# EAGLE design Domino Single Ethernet PoE No Teardrop (EAGLE 6.5.0)
DATABASE: ./../Common/BOM/Domino_DB.txt; DRAWN: M.STEMPIN; REV: A
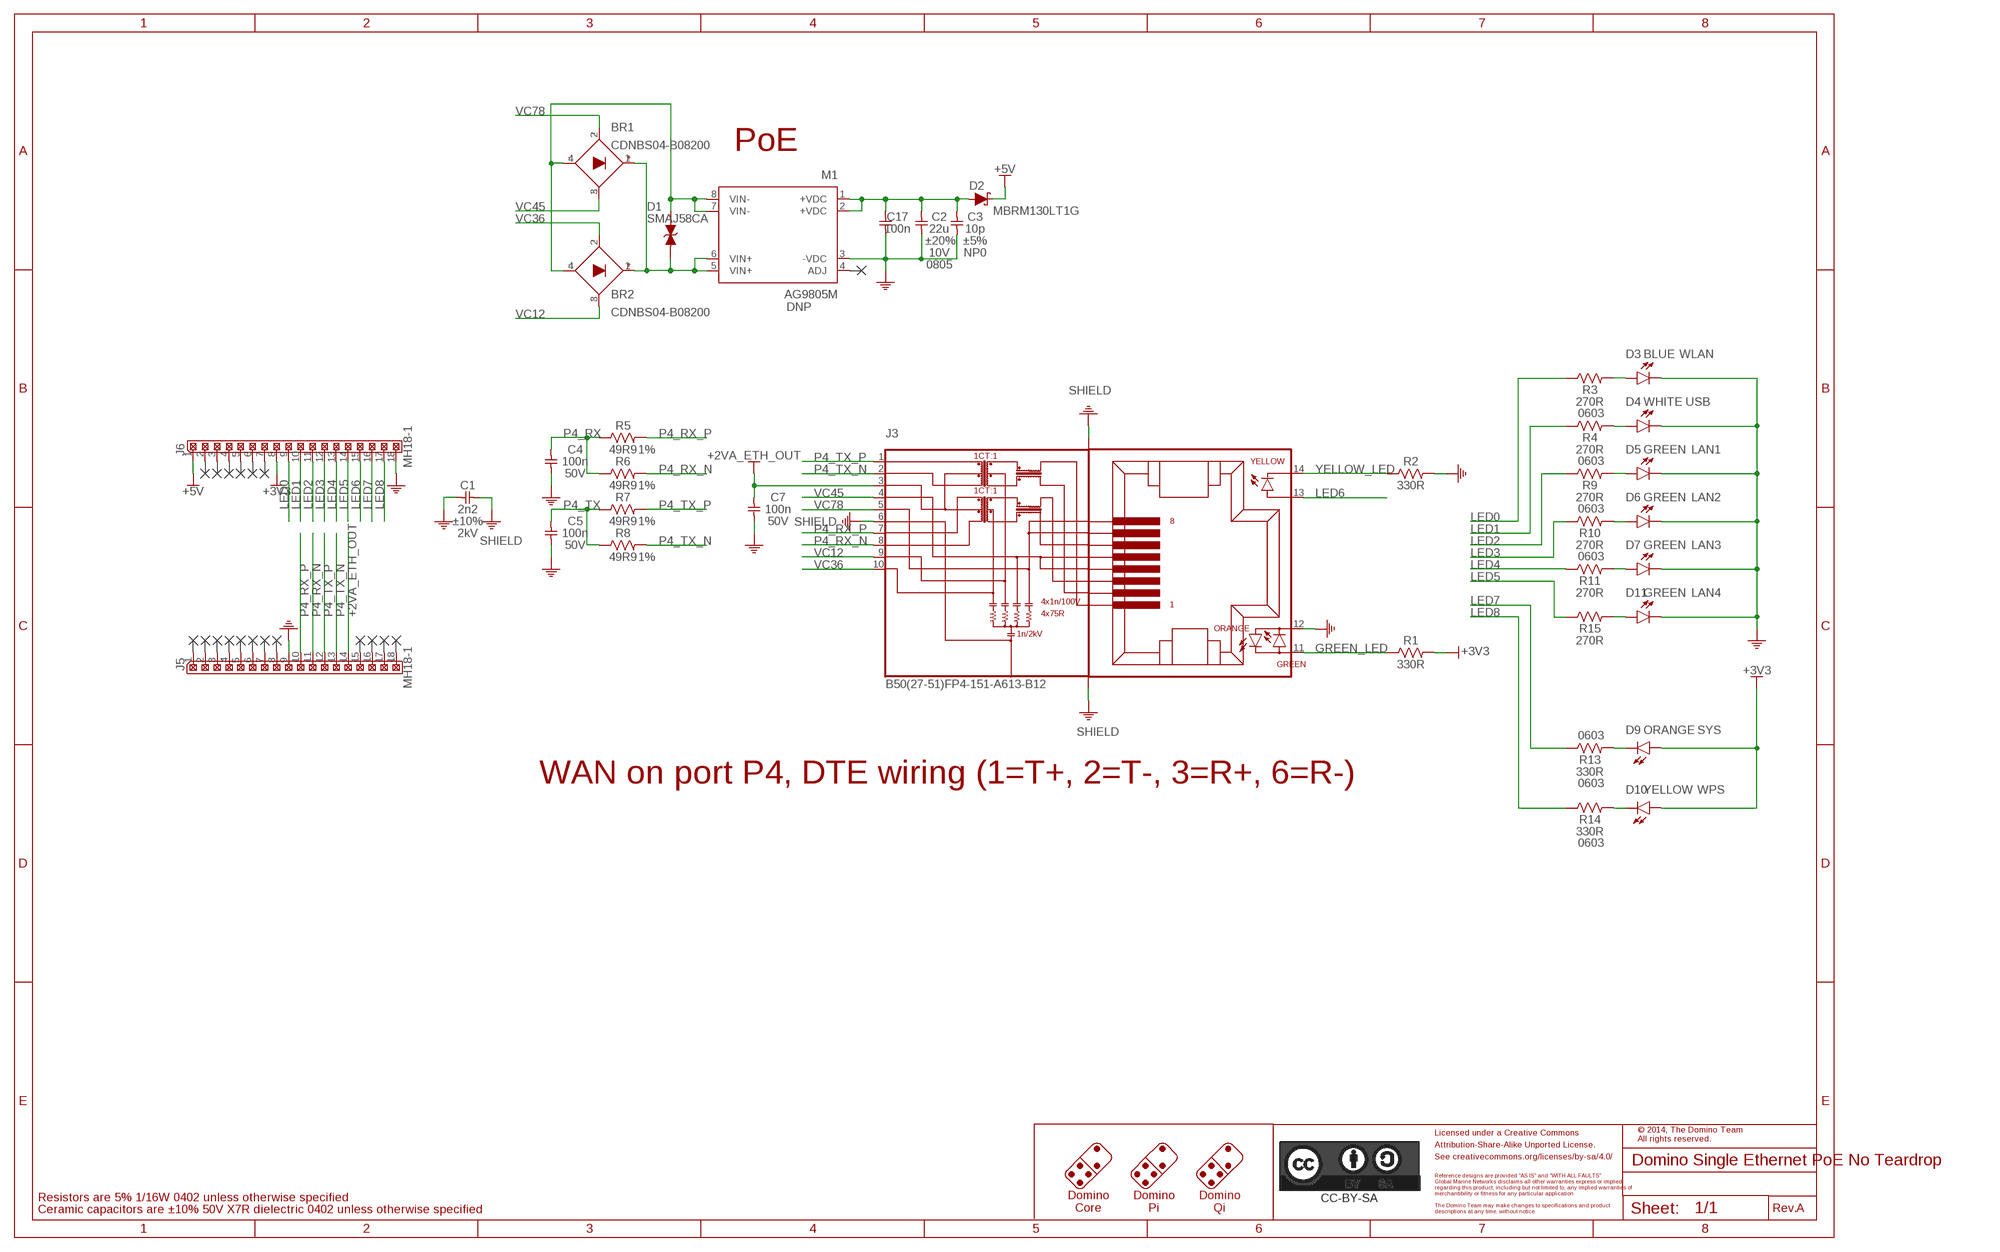
[diagram p0: schematic, sheet 1]
PORT1 (NC): BOM: EXCLUDE
PORT2 (NC): BOM: EXCLUDE
PORT3 (NC): BOM: EXCLUDE
PORT4 (NC): BOM: EXCLUDE
PORT5 (NC): BOM: EXCLUDE
PORT6 (NC): BOM: EXCLUDE
PORT7 (NC): BOM: EXCLUDE
PORT8 (NC): BOM: EXCLUDE
PORT9 (NC): BOM: EXCLUDE
PORT10 (NC): BOM: EXCLUDE
PORT11 (NC): BOM: EXCLUDE
PORT12 (NC): BOM: EXCLUDE
PORT13 (NC): BOM: EXCLUDE
PORT14 (NC): BOM: EXCLUDE
PORT15 (NC): BOM: EXCLUDE
PORT22 (NC): BOM: EXCLUDE
PORT26 (NC): BOM: EXCLUDE
PORT27 (NC): BOM: EXCLUDE
PORT28 (NC): BOM: EXCLUDE

## Parts
BR1  CDNBS04-B08200  [NBS04]
BR2  CDNBS04-B08200  [NBS04]
C1  2n2  CAP_1206  [C1206]
C2  22u  CAP_0805  [C0805]
C3  10p  CAP_0402  [C0402]
C4  100n  CAP_0402  [C0402]
C5  100n  CAP_0402  [C0402]
C7  100n  CAP_0402  [C0402]
C17  100n  CAP_0402  [C0402]
CC-BY-SA1  CC-BY-SA_LOGO  [CC-BY-SA_LOGO]
D1  SMAJ58CA  [SMA]
D2  MBRM130LT1G  [DO-216AA]
D3  BLUE  LED_0603  [LED0603]
D4  WHITE  LED_0603  [LED0603]
D5  GREEN  LED_0603  [LED0603]
D6  GREEN  LED_0603  [LED0603]
D7  GREEN  LED_0603  [LED0603]
D9  ORANGE  LED_0603  [LED0603]
D10  YELLOW  LED_0603  [LED0603]
D11  GREEN  LED_0603  [LED0603]
J3  B50(27-51)FP4-151-A613-B12  [B50(27-51)FP4-151-A613-B12]
J5  MH18-1  [MH18-1-0.1]
J6  MH18-1  [MH18-1-0.1]
M1  AG9805M  [AG9800M]
R1  330R  RES_0402  [R0402]
R2  330R  RES_0402  [R0402]
R3  270R  RES_0603  [R0603]
R4  270R  RES_0603  [R0603]
R5  49R9  RES_0402  [R0402]
R6  49R9  RES_0402  [R0402]
R7  49R9  RES_0402  [R0402]
R8  49R9  RES_0402  [R0402]
R9  270R  RES_0603  [R0603]
R10  270R  RES_0603  [R0603]
R11  270R  RES_0603  [R0603]
R13  330R  RES_0603  [R0603]
R14  330R  RES_0603  [R0603]
R15  270R  RES_0603  [R0603]

## Nets
+: BR1.1(+) BR2.1(+) D1.C M1.5(VIN+) M1.6(VIN+)
+2VA_ETH_OUT: C7.2 J3.3 J5.14
+3V3: D9.2(A) D10.2(A) J6.8 R1.2
+5V: D2.1(C) J6.1
+VDC@1: C2.1 C3.1 C17.1 D2.2(A) M1.1(+VDC) M1.2(+VDC)
-: BR1.4(-) BR2.4(-) D1.A M1.7(VIN-) M1.8(VIN-)
GND: C1.1 C2.2 C3.2 C4.1 C5.1 C7.1 C17.2 D3.1(C) D4.1(C) D5.1(C) D6.1(C) D7.1(C) D11.1(C) J3.12 J5.9 J6.18 M1.3(-VDC) R2.2
GREEN_LED: J3.11 R1.1
LED0: J6.9 R3.1
LED1: J6.10 R4.1
LED2: J6.11 R9.1
LED3: J6.12 R10.1
LED4: J6.13 R11.1
LED5: J6.14 R15.1
LED6: J3.13 J6.15
LED7: J6.16 R13.1
LED8: J6.17 R14.1
N$2: D3.2(A) R3.2
N$3: D4.2(A) R4.2
N$4: D5.2(A) R9.2
N$5: D6.2(A) R10.2
N$6: D7.2(A) R11.2
N$8: D9.1(C) R13.2
N$9: D10.1(C) R14.2
N$10: D11.2(A) R15.2
P4_RX: C4.2 R5.1 R6.1
P4_RX_N [Ethernet]: J3.8 J5.11 R6.2
P4_RX_P [Ethernet]: J3.7 J5.10 R5.2
P4_TX: C5.2 R7.1 R8.1
P4_TX_N [Ethernet]: J3.2 J5.13 R8.2
P4_TX_P [Ethernet]: J3.1 J5.12 R7.2
SHIELD: C1.2 J3.6 J3.SH$1(SHIELD) J3.SH$2(SHIELD)
VC12 [PoE]: BR2.3(AC2) J3.9
VC36 [PoE]: BR2.2(AC1) J3.10
VC45 [PoE]: BR1.3(AC2) J3.4
VC78 [PoE]: BR1.2(AC1) J3.5
YELLOW_LED: J3.14 R2.1
Unconnected: J5.1 J5.2 J5.3 J5.4 J5.5 J5.6 J5.7 J5.8 J5.15 J5.16 J5.17 J5.18 J6.2 J6.3 J6.4 J6.5 J6.6 J6.7 M1.4(ADJ)

## Notes on the sheet
- PoE
- WLAN
- USB
- LAN1
- LAN2
- LAN3
- LAN4
- SYS
- WAN on port P4, DTE wiring (1=T+, 2=T-, 3=R+, 6=R-)
- WPS
- Licensed under a Creative Commons
- © 2014, The Domino Team
  All rights reserved.
- Attribution-Share-Alike Unported License.
- See creativecommons.org/licenses/by-sa/4.0/
- Reference designs are provided "AS IS" and "WITH ALL FAULTS".
- Global Marine Networks disclaims all other warranties express or implied,
- regarding this product, including but not limited to, any implied warranties of
- merchantibility or fitness for any particular application.
- Resistors are 5% 1/16W 0402 unless otherwise specified
- Domino
  Core
- Domino
  Pi
- Domino
  Qi
- The Domino Team may make changes to specifications and product
- Ceramic capacitors are ±10% 50V X7R dielectric 0402 unless otherwise specified | descriptions at any time, without notice. | Rev.

## Library data of the parts
BR1 BR2 = Domino:CDNBS04-B08: Surface Mount Rectifier; PARTNO: CDNBS04-B08200; VOLT: 200V
C1 = Domino:CAP_: Capacitor; PARTNO: C1210_2n2_X7R_10%_CER_2kV; SIZE: 1206; TC: X7R; TOL: ±10%; TYPE: CER; VOLT: 2kV
C2 = Domino:CAP_: Capacitor; PARTNO: C1206_22u_X7R_20%_CER_10V; SIZE: 0805; TC: X7R; TOL: ±20%; TYPE: CER; VOLT: 10V
C3 = Domino:CAP_: Capacitor; PARTNO: C0402_10p_NP0_5%_CER_50V; SIZE: 0402; TC: NP0; TOL: ±5%; TYPE: CER; VOLT: 50V
C4 C5 C7 C17 = Domino:CAP_: Capacitor; PARTNO: C0402_100n_X7R_10%_CER_50V; SIZE: 0402; TC: X7R; TOL: ±10%; TYPE: CER; VOLT: 50V
CC-BY-SA1 = Domino:CC-BY-SA_LOGO: Attribution-Share-Alike Unported License See creativecommons.org/licenses/by-sa/3.0/ for details.; BOM: EXCLUDE
D1 = Domino:SMAJ58CA: Transient Votlage Suppression (TVS) Diode
D2 = Domino:MBRM130: Schottky Barrier Rectifier, 1A, 30V; PARTNO: MBRM130LT1G; RATE: 1A; VOLT: 30V
D3 = Domino:LED_: LED; PARTNO: LED0603-BLUE
D4 = Domino:LED_: LED; PARTNO: LED0603-WHITE
D5-D7 D11 = Domino:LED_: LED; PARTNO: LED0603-GREEN
D9 = Domino:LED_: LED; PARTNO: LED0603-ORANGE
D10 = Domino:LED_: LED; PARTNO: LED0603-YELLOW
J3 = Domino:B50(27-51)FP4-151-A613-B12: Single Port RJ45 100Base-T with PoE, Transformer, 1 Magnetic Ring, 15 Pins, 3 LEDs (Left Orange/Green, Right Yellow) Without Shielding Shell Shrapnel, 3µ Gold, Pin Back, PA66 material, No Logo; PARTNO: B50(27-51)FP4-151-A613-B12
J5 J6 = Domino:MH18-1: 18x1 Pin Male Header
M1 = Domino:AG98*M: Miniature PoE Module; DNP: T; PARTNO: Ag9800M; RATE: 9W; VOLT: 5V
R1 R2 = Domino:RES_: Resistor; PARTNO: R0402_330R_5%_62.5mW; RATE: 62.5mW; SIZE: 0402; TOL: 5%
R3 R4 R9-R11 R15 = Domino:RES_: Resistor; PARTNO: R0603_270R_5%_125mW; RATE: 125mW; SIZE: 0603; TOL: 5%
R5-R8 = Domino:RES_: Resistor; PARTNO: R0402_49R9_1%_62.5mW; RATE: 62.5mW; SIZE: 0402; TOL: 1%
R13 R14 = Domino:RES_: Resistor; PARTNO: R0603_330R_5%_125mW; RATE: 125mW; SIZE: 0603; TOL: 5%

## Net classes
1 Ethernet: width 0.254 mm, clearance 0.152 mm to class 0, clearance 0.152 mm
2 PoE: width 0.457 mm, clearance 0.254 mm to class 0, clearance 0.254 mm to class 1, clearance 0.254 mm

## Board
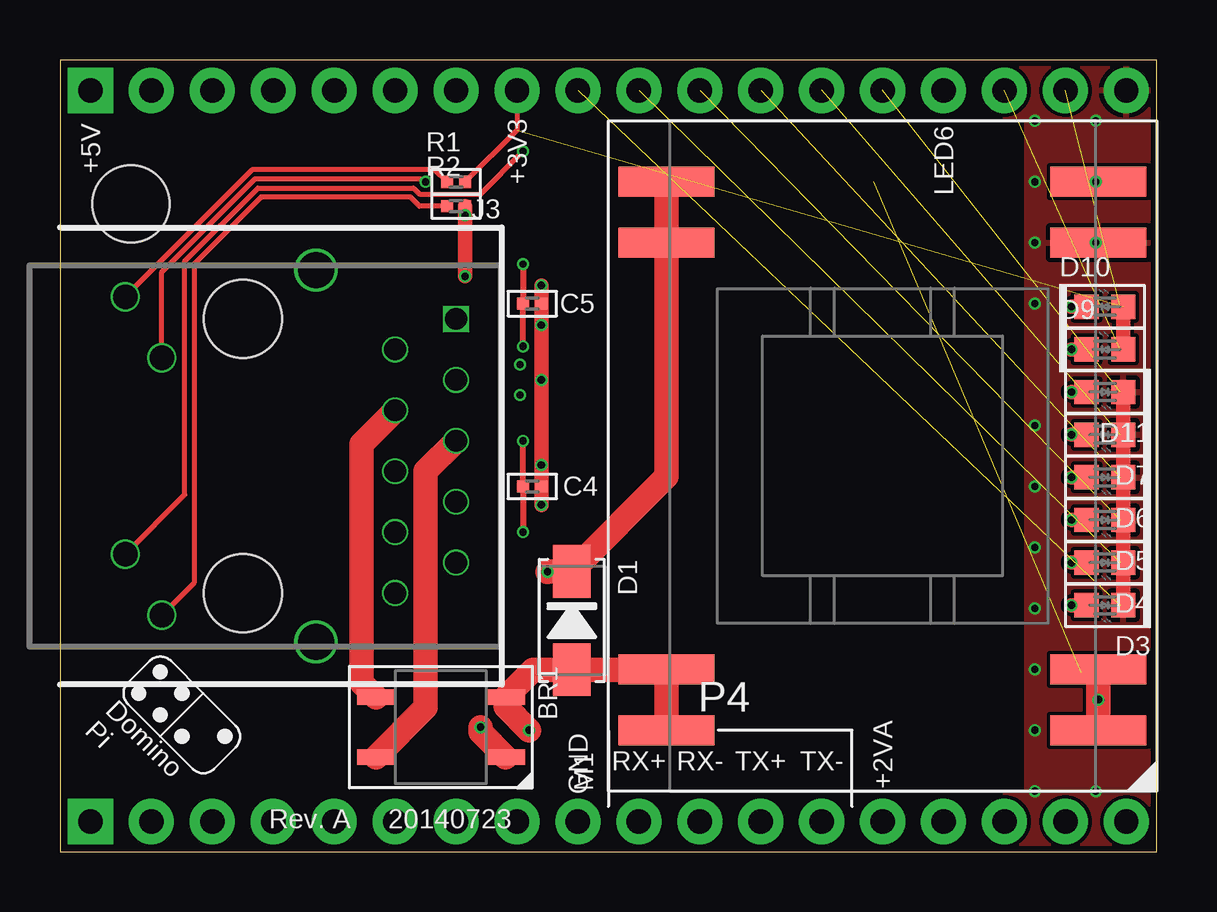
[diagram p1: board, top side]
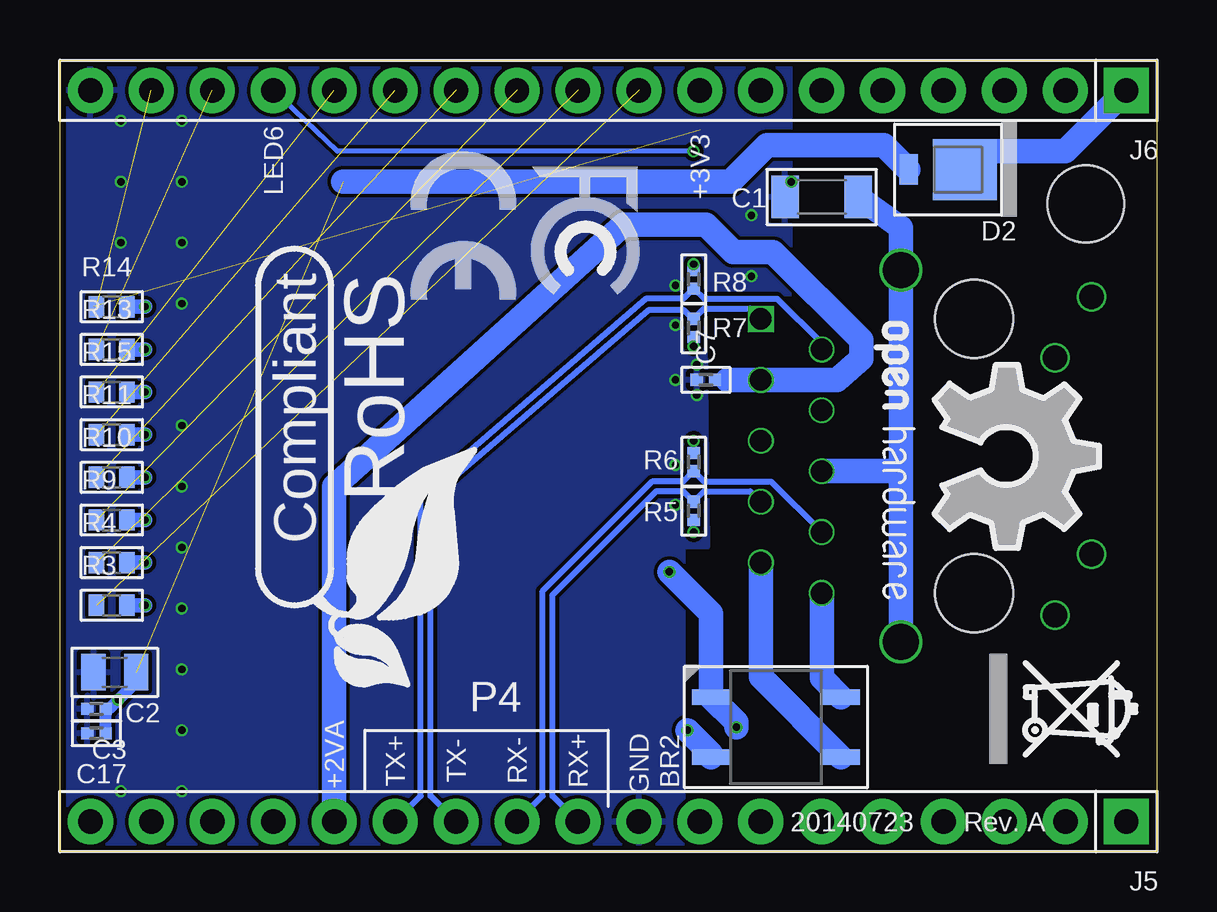
[diagram p2: board, bottom side, seen from below]

Size 45.72 x 33.02 mm. Coordinates in mm from the lower left corner, seen from the top.
Outline: 0,0 45.72,0 45.72,33.02 0,33.02 0,0
Copper layers (1*16): Top 0.043mm / dielectric 1mm / Bottom 0.043mm
Design rules "Domino": minimum track width 0.1mm, minimum drill 0.3mm, track to track 6mil, track to pad 6mil, pad to pad 6mil, via to via 6mil, smd to smd 0mil, copper to edge 0.25mm, drill to drill 0.35mm, minimum pad ring 0.085mm, minimum via ring 0.1mm, stop-mask expansion 0mil, vias tented up to drill 0.45mm, thermal gap 0.2mm
Holes 3.2 mm at 2.96,27.02

### Footprints (pad centres in the part's own frame; a part is rotated, then mirrored left to right if it is on the bottom)
NBS04 = smd 0.65 x 1.6: 1 1.25,2.7; 2 1.25,-2.7; 3 -1.25,-2.7; 4 -1.25,2.7
C1206 = smd 1.143 x 1.778: 1 -1.524,0; 2 1.524,0
C0805 = smd 1.016 x 1.524: 1 -0.889,0; 2 0.889,0
C0402 = smd 0.508 x 0.508: 1 -0.381,0; 2 0.381,0
SMA = smd 2.2 x 1.55: A 2.05,0; C -2.05,0
DO-216AA = smd 2.667 x 2.54: 1 -1.651,0 | smd 0.762 x 1.27: 2 0.699,0
LED0603 = smd 1.016 x 1.016: 1 -0.762,0; 2 0.762,0
B50(27-51)FP4-151-A613-B12 = drill 0.9 square: 1 -5.715,8.89 | drill 0.9: 2 -4.445,6.35; 3 -3.175,8.89; 4 -1.905,6.35; 5 -0.635,8.89; 6 0.635,6.35; 7 1.905,8.89; 8 3.175,6.35; 9 4.445,8.89; 10 5.715,6.35 | drill 1.02: 11 -6.64,-4.9; 12 -4.1,-3.38; 13 4.1,-4.9; 14 6.64,-3.38 | drill 1.5: SH$1 -7.75,3.05; SH$2 7.75,3.05 | hole 3.25: -5.715,0; 5.715,0
MH18-1-0.1 = drill 1.016 pad 1.88 square: 1 0,0 | drill 1.016 pad 1.88: 2 2.54,0; 3 5.08,0; 4 7.62,0; 5 10.16,0; 6 12.7,0; 7 15.24,0; 8 17.78,0; 9 20.32,0; 10 22.86,0; 11 25.4,0; 12 27.94,0; 13 30.48,0; 14 33.02,0; 15 35.56,0; 16 38.1,0; 17 40.64,0; 18 43.18,0
AG9800M = smd 1.25 x 4: 1 -11.43,-9; 2 -8.89,-9; 3 8.89,-9; 4 11.43,-9; 5 11.43,9; 6 8.89,9; 7 -8.89,9; 8 -11.43,9
R0402 = smd 0.508 x 0.508: 1 -0.381,0; 2 0.381,0
R0603 = smd 0.635 x 0.889: 1 -0.635,0; 2 0.635,0

### Placement (x,y rotation side)
BR1  15.88,5.21 270 top
BR2  15.88,5.21 90 bottom
C1  13.97,27.3 0 bottom
C2  43.43,7.49 180 bottom
C3  44.2,5.97 180 bottom
C4  19.68,15.24 180 top
C5  19.68,22.86 180 top
C7  18.8,19.68 0 bottom
C17  44.2,4.95 180 bottom
CC-BY-SA1  -5.08,-50.8 0 top  (outside the outline)
D1  21.34,9.65 270 top
D2  9.65,28.45 180 bottom
D3  43.56,10.29 180 top
D4  43.56,12.06 180 top
D5  43.56,13.84 180 top
D6  43.56,15.62 180 top
D7  43.56,17.4 180 top
D9  43.56,20.95 0 top
D10  43.56,22.73 0 top
D11  43.56,19.18 180 top
DRILEGEND  [DRILEGEND]  81.53,59.94 0 top  (outside the outline)
J3  7.62,16.51 270 top
J5  1.27,1.27 180 bottom
J6  1.27,31.75 180 bottom
M1  34.29,16.51 90 top
R1  16.51,27.94 0 top
R2  16.51,26.92 0 top
R3  43.56,10.29 0 bottom
R4  43.56,12.06 0 bottom
R5  19.3,14.22 90 bottom
R6  19.3,16.26 270 bottom
R7  19.3,21.84 90 bottom
R8  19.3,23.88 270 bottom
R9  43.56,13.84 0 bottom
R10  43.56,15.62 0 bottom
R11  43.56,17.4 0 bottom
R13  43.56,20.95 0 bottom
R14  43.56,22.73 0 bottom
R15  43.56,19.18 0 bottom
U$3  [A5L-LOC]  -55.88,-62.23 0 top  (outside the outline)
U$4  [DOMINO_LOGO_SMALL]  5.08,5.71 270 top
U$5  [CE_LOGO_SMALL]  31.11,29.21 270 bottom
U$6  [FCC_LOGO_SMALL]  26.04,28.57 270 bottom
U$7  [OPEN_HARDWARE_LOGO]  6.35,16.51 270 bottom
U$8  [RECYCLE_BIN_LOGO]  6.99,8.26 270 bottom
U$9  [ROHS_LOGO]  36.83,24.13 270 bottom

### Tracks (layer width: path | path; a pad name or v marks a point on that pad's centre or on a via)
+  (via drill 0.3)
  Top 1.016: M1.5 M1.6 25.29,15.66 D1.C 20.34,11.7 v20.32,11.68 | BR1.1 17.53,5.01 v17.53,5.21
  Bottom 1.016: v20.32,11.68 18.57,9.94 BR2.1 17.53,5.41 v17.53,5.21
+2VA_ETH_OUT
  Bottom 0.508: 17.91,19.68 C7.2
  Bottom 1.016: J5.14 34.29,15.24 22.23,26.16 18.8,26.16 17.65,25.02 16,25.02 12.32,21.34 12.32,20.57 13.34,19.68 J3.3 17.91,19.68
+3V3  (1 unrouted)
  Top 0.203: J6.8 19.05,30.1 R1.2
  Top 0.61: D9.2 D10.2
+5V
  Bottom 1.016: J6.1 3.81,29.21 8,29.21 D2.1
+VDC@1  (via drill 0.3)  (1 unrouted)
  Top 1.016: M1.1 v43.29,6.35 M1.2
  Bottom 0.508: C2.1 42.55,7.09 v43.29,6.35 43.67,5.97 C3.1 C17.1
  Bottom 1.016: D2.2 11.37,29.46 16.26,29.46 17.78,27.94 33.91,27.94
-  (via drill 0.3)
  Top 1.016: M1.8 M1.7 24.89,7.62 24.87,7.6 D1.A 19.72,7.6 BR1.4 18.57,6.06 v19.56,5.08
  Bottom 1.016: BR2.4 18.57,4.1 v19.56,5.08
GND  (via drill 0.3, 0.3 pad 0.03)
  Top 0.203: J3.12 4.24,24.18 8.13,28.07 15.11,28.07 v15.24,27.94
  Top 0.61: v20.07,23.62 C5.1 v20.07,21.97 C4.1 v20.07,14.48 | v16.89,24 v16.89,26.54 R2.2 | D11.1 D7.1 D6.1 D5.1 D4.1 D3.1
  other vias: 40.64,2.54 43.18,2.54 40.64,5.08 40.64,7.62 40.64,10.16 40.64,12.7 40.64,15.24 40.64,17.78 40.64,22.86 40.64,25.4 43.18,25.4 40.64,27.94 43.18,27.94 40.64,30.48 43.18,30.48 20.07,19.68 19.18,20.32 19.18,19.05 20.07,16.13
  pour Top: 45.72,33.02 45.72,0 39.37,0 39.37,33.02
  pour Bottom: 45.72,33.02 45.72,0 19.68,0 19.68,12.7 18.67,12.7 18.8,23.24 15.24,23.24 15.24,33.05
GREEN_LED
  Top 0.203: J3.11 8.02,28.45 15.62,28.45 R1.1
LED0  (1 unrouted)
LED1  (1 unrouted)
LED2  (1 unrouted)
LED3  (1 unrouted)
LED4  (1 unrouted)
LED5  (1 unrouted)
LED6  (via drill 0.3)
  Top 0.203: J3.13 5.21,14.9 5.21,24.64 8.26,27.69 14.73,27.69 14.99,27.43 17.53,27.43 v19.3,29.21
  Bottom 0.203: v19.3,29.21 34.16,29.21 J6.15
LED7  (1 unrouted)
LED8  (1 unrouted)
N$2  (via drill 0.3)
  Top 0.61: v42.16,10.29 D3.2
  Bottom 0.61: R3.2 v42.16,10.29
N$3  (via drill 0.3)
  Top 0.61: v42.16,12.06 D4.2
  Bottom 0.61: R4.2 v42.16,12.06
N$4  (via drill 0.3)
  Top 0.61: D5.2 v42.16,13.84
  Bottom 0.61: v42.16,13.84 R9.2
N$5  (via drill 0.3)
  Top 0.61: v42.16,15.62 D6.2
  Bottom 0.61: R10.2 v42.16,15.62
N$6  (via drill 0.3)
  Top 0.61: v42.16,17.4 D7.2
  Bottom 0.61: R11.2 v42.16,17.4
N$8  (via drill 0.3)
  Top 0.61: v42.16,20.95 D9.1
  Bottom 0.61: R13.2 v42.16,20.95
N$9  (via drill 0.3)
  Top 0.61: v42.16,22.73 D10.1
  Bottom 0.61: R14.2 v42.16,22.73
N$10  (via drill 0.3)
  Top 0.61: D11.2 v42.16,19.18
  Bottom 0.61: v42.16,19.18 R15.2
P4_RX  (via drill 0.3 pad 0.03)
  Top 0.254: v19.3,13.34 C4.2 v19.3,17.14
  Bottom 0.254: v19.3,13.34 R5.1 | v19.3,17.14 R6.1
P4_RX_N
  Bottom 0.254: J3.8 16.08,15.44 18.87,15.44 R6.2 19.74,15.44 21.04,15.44 25.6,10.88 25.6,2.34 J5.11
P4_RX_P
  Bottom 0.254: J3.7 16.94,15.04 18.87,15.04 R5.2 19.74,15.04 20.87,15.04 25.2,10.71 25.2,2.34 J5.10
P4_TX  (via drill 0.3)
  Top 0.254: v19.3,21.08 C5.2 v19.3,24.51
  Bottom 0.254: R7.1 v19.3,21.08 | R8.1 v19.3,24.51
P4_TX_N
  Bottom 0.254: J3.2 13.97,21.21 15.82,23.06 18.87,23.06 R8.2 19.74,23.06 21.29,23.06 30.68,14.94 30.68,2.34 J5.13
P4_TX_P
  Bottom 0.254: J3.1 16.94,22.66 18.87,22.66 R7.2 19.34,22.23 19.7,22.59 21.19,22.59 30.28,14.78 30.28,2.34 J5.12
SHIELD
  Bottom 1.016: 10.67,15.88 J3.SH$1 10.67,26.04 C1.2 | J3.6 10.67,15.88 | 10.67,15.88 J3.SH$2
VC12
  Bottom 1.016: J3.9 16.51,7.29 BR2.3
VC36
  Bottom 1.016: J3.10 13.97,7.25 BR2.2
VC45
  Top 1.016: J3.4 12.57,17.02 12.57,7.06 BR1.3
VC78
  Top 1.016: J3.5 15.24,15.88 15.24,6.02 BR1.2
YELLOW_LED
  Top 0.203: J3.14 5.59,11.22 5.59,24.51 8.38,27.3 14.61,27.3 14.99,26.92 R2.1

### Text on the board
tPlace: +5V | +3V3 | LED6 | P4 | GND | RX+ | RX- | TX+ | TX- | +2VA
bPlace: +3V3 | LED6 | P4 | GND | RX+ | RX- | TX- | TX+ | +2VA
tNames: Rev. A
bNames: Rev. A
Document: DRILL CHART: TOP TO BOTTOM | LINE WIDTH IMPEDANCE CHART FOR REFERENCE | Class | Ethernet | Type | Diff Coated Coplanar Waveguide With Ground 1B | Layer | Impedance | Trace Width | Trace Separation | Ground Separation | TOP, / BOTTOM | 100 Ohms | 10 mils | 6 mils | 6 mils | STACK-UP FOR REFERENCE | LAYER 1 L1 TOP | 18 UM CU + 12.5 UM PLATING (30.5 UM) | 1.061 MM+/-10% | CORE | 1.0 MM CORE FR-4 LG 135 / INCLUDING COPPER | LAYER 4 L16 BOTTOM | 18 UM CU + 12.5 UM PLATING (30.5 UM) | NOTES: | 1. PRINTED CIRCUIT BOARD MADE FROM NEMA GRADE FR-4 TG 135 EPOXY / LAMINATE WITH 18 UM COPPER PLATING AND 1 MM THICKNESS. | 2. ALL DIMENSIONS ARE GIVEN IN MILLIMETERS EXCEPT TRACE WIDTH/SPACE. | 3. CIRCUIT PATHS ARE FOR REFERENCE ONLY. | 4. HOLE SIZES SHOWN ARE FINISHED DIAMETERS AFTER PLATING. | 5. BOARD PLATED USING REFLOW OR SIMILAR METHOD. | 6. BOARD TO HAVE WHITE SOLDER MASK ON PLATED SURFACES USING WET / FILM SR100 OR SR1010 EPOXY. / EQUIVALENT WET OR DRY FILM MAY BE USED. | 7. SILKSCREEN BOARD USING BLACK INK. DISTORTION OF SILKSCREEN / IS ACCEPTABLE OVER TRACES. EPOXY INK ON PLATED LANDS IS NOT / ACCEPTABLE | 8. THE FOLLOWING INFORMATION APPLIES TO THIS BOARD: | * 2 COPPER LAYERS | * 1 MM BOARD THICKNESS | * REQUIRES TOP AND BOTTOM SIDE SILKSCREENS | © 2014, The Domino Team. / All rights reserved. | Licensed under a Creative Commons / Attribution-Share-Alike Unported License. / See creativecommons.org/licenses/by-sa/4.0/ | Reference designs are provided "AS IS" and "WITH ALL FAULTS". / The Domino Team disclaims all other warranties express or implied, / regarding this product, including but not limited to, any implied warranties of / merchantibility or fitness for any particular application. | Domino / Core | Domino / Pi | Domino / Qi | The Domino Team may make changes to specifications and product descriptions / at any time, without notice. | Rev.
DrillLegend: LAYER-STACK
DrillLegend_01-16: 01-16
DrillLegend_01-20: 01-20
Pinout: GND | P4_RX+ | P4_RX- | P4_TX+ | P4_TX- | +2VA_ETH_OUT | Pinout (.PIN)
Component_side: Component Side (.CMP)
Solder_side: Solder side (.SOL)
Silk_screen_CMP: Silk screen CMP (.PLC)
Silk_screen_SOL: Silk screen SOL (.PLS)
Solder_stop_mask_CMP: Solder stop mask CMP (.STC)
Solder_stop_mask_SOL: Solder stop mask SOL (.STS)
Cream_frame_CMP: Cream frame CMP (.CRC)
Cream_frame_SOL: Cream frame SOL (.CRS)
Drill_data: Drill data (.DRD)
Component_Assembly_CMP: Component Assembly CMP (.ASC)
Component_Assembly_SOL: Component Assembly SOL (.ASS)
Outline: Outline (.OLN)